# Altium schematic sheet Sheet1.SchDoc
size A4
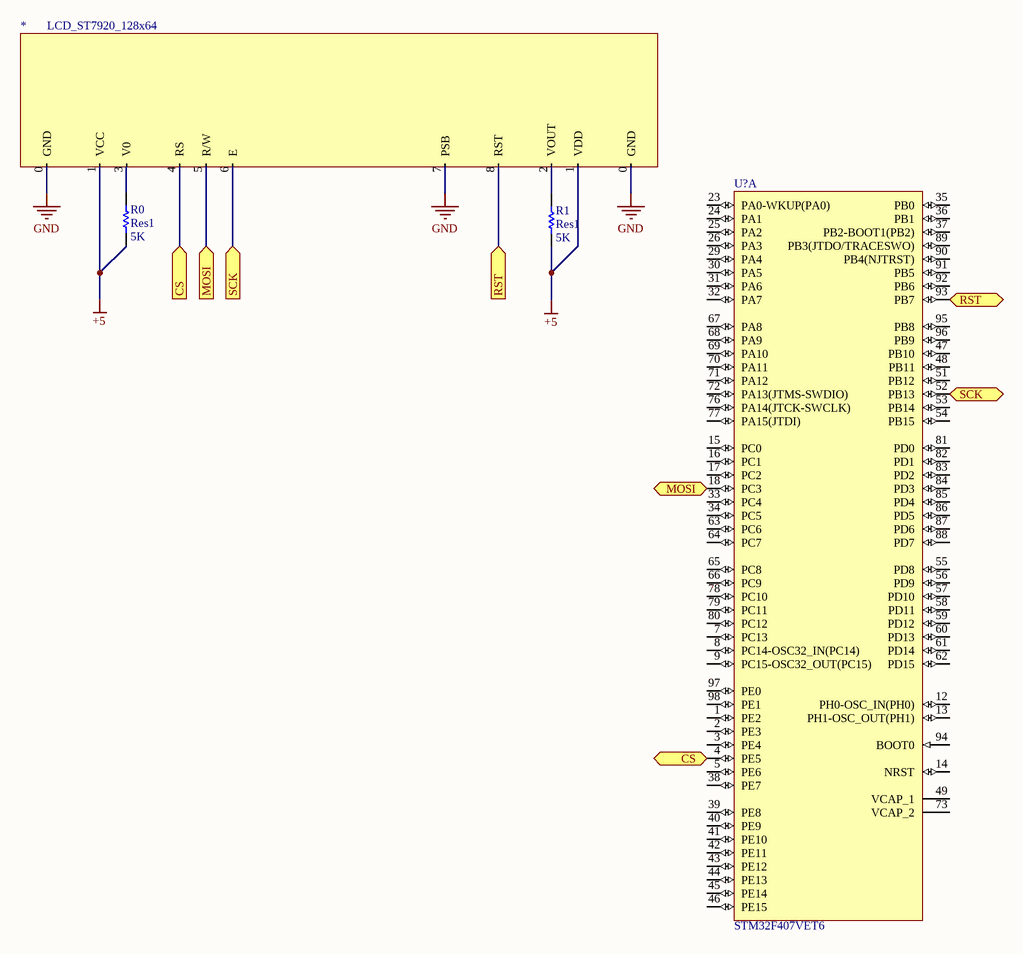
[diagram p0: Sheet1.SchDoc]

## Parts
*  LCD_ST7920_128x64
R0  Res1  value 5K  [AXIAL-0.3]
R1  Res1  value 5K  [AXIAL-0.3]
U?  STM32F407VET6  [STM-LQFP100_N]  (part A of 2)

## Ports
CS (in), CS (out), MOSI (in), MOSI (out), RST (in), RST (out), SCK (in), SCK (out)

## Nets
+5: *.1(VCC) R0.1 R1.1
GND: *.0(GND) *.7(PSB)
CS: *.4(RS) U?.4(PE5) ; port CS
MOSI: *.5(R/W) U?.18(PC3) ; port MOSI
RST: *.8(RST) U?.93(PB7) ; port RST
SCK: *.6(E) U?.52(PB13) ; port SCK
Net*_2: *.2(VOUT) R1.2
Net*_3: *.3(V0) R0.2

Not connected (* = marked no-connect by the designer): U? 1(PE2) 2(PE3) 3(PE4) 5(PE6) 7(PC13) 8(PC14-OSC32_IN(PC14)) 9(PC15-OSC32_OUT(PC15)) 12(PH0-OSC_IN(PH0)) 13(PH1-OSC_OUT(PH1)) 14(NRST) 15(PC0) 16(PC1) 17(PC2) 23(PA0-WKUP(PA0)) 24(PA1) 25(PA2) 26(PA3) 29(PA4) 30(PA5) 31(PA6) 32(PA7) 33(PC4) 34(PC5) 35(PB0) 36(PB1) 37(PB2-BOOT1(PB2)) 38(PE7) 39(PE8) 40(PE9) 41(PE10) 42(PE11) 43(PE12) 44(PE13) 45(PE14) 46(PE15) 47(PB10) 48(PB11) 49(VCAP_1) 51(PB12) 53(PB14) 54(PB15) 55(PD8) 56(PD9) 57(PD10) 58(PD11) 59(PD12) 60(PD13) 61(PD14) 62(PD15) 63(PC6) 64(PC7) 65(PC8) 66(PC9) 67(PA8) 68(PA9) 69(PA10) 70(PA11) 71(PA12) 72(PA13(JTMS-SWDIO)) 73(VCAP_2) 76(PA14(JTCK-SWCLK)) 77(PA15(JTDI)) 78(PC10) 79(PC11) 80(PC12) 81(PD0) 82(PD1) 83(PD2) 84(PD3) 85(PD4) 86(PD5) 87(PD6) 88(PD7) 89(PB3(JTDO/TRACESWO)) 90(PB4(NJTRST)) 91(PB5) 92(PB6) 94(BOOT0) 95(PB8) 96(PB9) 97(PE0) 98(PE1)

## Library data of the parts
R0 R1 = Res1: Resistor; Published: 8-Jun-2000; LatestRevisionDate: 17-Jul-2002; LatestRevisionNote: Re-released for DXP Platform.; PackageReference: AXIAL-0.3; Publisher: Altium Limited; PackageDescription: Axial Device, Thru-Hole; 2 Leads; 0.3 in Pin Spacing
U? = STM32F407VET6: ARM Cortex-M4 32-bit MCU+FPU, 210 DMIPS, 512 kB Flash, 192 kB Internal RAM, 82 I/Os, 100-pin LQFP, -40 to 85 degC, Tray; Manufacturer: STMicroelectronics; D/A Converter: 2x12-bit; FLASH Size (Prog) (kB): 512; I/Os (High Current): 82; Internal RAM Size (kB): 192; Operating Frequency(F) (Processor speed) (MHz): 168; Supply Voltage(Vcc) max (V): 3.6; Supply Voltage(Vcc) min (V): 1.8; DatasheetVersion: Rev. 4; PackageVersion: Rev. 1, 06/2013; PackageReference: LQFP100; PackageDescription: 100-Pin Low Profile Quad Flat Package, 14 x 14 mm Body, 0.5 mm Pitch; Supplier 1: Digi-Key; Supplier Part Number 1: 497-12075-ND; Supplier 2: Farnell; Supplier Part Number 2: 2064367; Supplier 3: Newark; Supplier Part Number 3: 73T2332; Supplier 4: Mouser; Supplier Part Number 4: 511-STM32F407VET6; Core: ARM Cortex-M4; Packing: Tray; Mounting Technology: Surface Mount; PartNumber: STM32F407VET6; ComponentLink1Description: Manufacturer URL; ComponentLink1URL: http://www.st.com/web/en/home.html; ComponentLink2Description: Datasheet; ComponentLink2URL: http://www.st.com/st-web-ui/static/active/en/resource/technical/document/datasheet/DM00037051.pdf; ComponentLink3Description: Package Specification; ComponentLink3URL: http://www.st.com/st-web-ui/static/active/en/resource/technical/document/data_brief/DM00071938.pdf